# Altium schematic sheet MAKKI_ISMAIL_ESPS3_CAM_1.SchDoc
size 282 x 199 mm; COMPANY: ADAFRUIT INDUSTRIES; DRAWN: KTOWN; REV: B; Origin: Eagle; OriginPath: C:\Users\aliam\OneDrive\Desktop\MAKKI_ISMAIL_ESPS3_CAM\MAKKI_ISMAIL_ESPS3_CAM\MAKKI_ISMAIL_ESPS3_CAM.sch; OriginSheet: 2; GateName_1: G$1; SymbolName_1: FRAME_A4; LibraryName: microbuilder; DeviceSetName: FRAME_A4
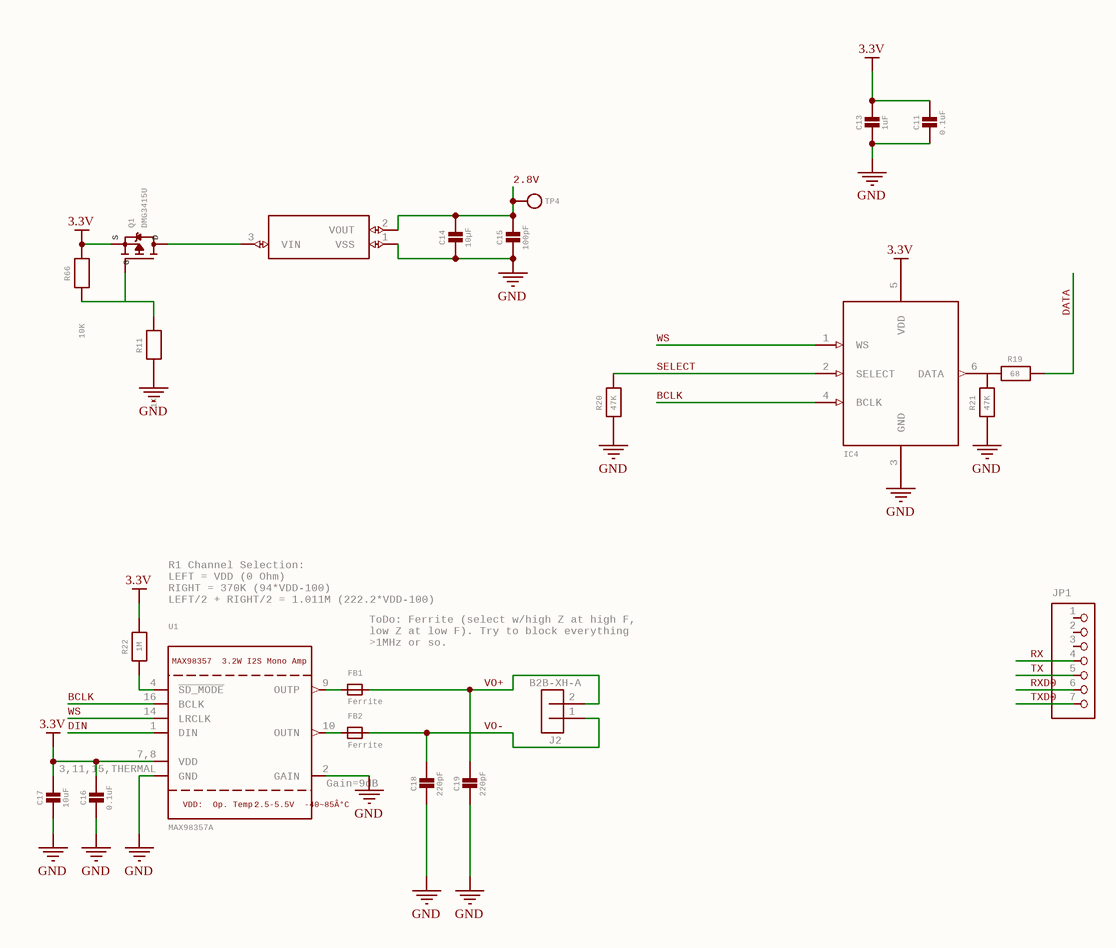
[diagram p0: MAKKI_ISMAIL_ESPS3_CAM_1.SchDoc]

## Parts
C11  0.1uF  [0603-NO]
C13  1uF  [0603-NO]
C14  10µF  [0805-NO]
C15  100pF  [0805-NO]
C16  0.1uF  [0805-NO]
C17  10uF  [0805-NO]
C18  220pF  [0805-NO]
C19  220pF  [0805-NO]
FB1  Ferrite  [0805-NO]
FB2  Ferrite  [0805-NO]
IC3  XC6206P282MR-G  [SOT95P280X130-3N]  (value not drawn)
IC4  ICS-43434  [SPH0645LM4H]  (value not drawn)
J2  B2B-XH-A  [B2B-XH-A]
JP1  HEADER-1X7THICKER  [1X07_ROUND_76]  (value not drawn)
Q1  DMG3415U  [SOT23-R]
R11  1K  [0603-NO]
R19  68  [0603-NO]
R20  47K  [0603-NO]
R21  47K  [0603-NO]
R22  1M  [0805-NO]
R66  10K  [0603-NO]
TP4  TESTPOINTROUND1.5MMNO  [TESTPOINT_ROUND_1.5MM_NO]  (value not drawn)
U1  MAX98357A  MAX98357
3.2WI2SMonoAmp: MAX98357 / 3.2W I2S Mono Amp  VDD:
Op.Temp: VDD: / Op. Temp:  2.5-5.5V
-40~85Â°C: 2.5-5.5V / -40~85Â°C  [QFN16_3MM]

## Nets
3.3V: C11.1 C13.1 C16.1 C17.1 IC4.5(VDD) Q1.2(S) R22.2 R66.2 U1.7,8(VDD)
GND: C11.2 C13.2 C14.2 C15.2 C16.2 C17.2 C18.2 C19.2 IC3.1(VSS) IC4.3(GND) R11.1 R20.1 R21.1 U1.2(GAIN) U1.3,11,15,THERMAL(GND)
2.8V: C14.1 C15.1 IC3.2(VOUT) TP4.P$1
BCLK: IC4.4(BCLK) U1.16(BCLK)
DATA: R19.2
DIN: U1.1(DIN)
RX: JP1.4
RXD0: JP1.6
SELECT: IC4.2(SELECT) R20.2
TX: JP1.5
TXD0: JP1.7
VO+: C19.1 FB1.2(P$2) J2.2
VO-: C18.1 FB2.2(P$2) J2.1
WS: IC4.1(WS) U1.14(LRCLK)
NetFB1_1: FB1.1(P$1) U1.9(OUTP)
NetFB2_1: FB2.1(P$1) U1.10(OUTN)
NetIC3_3: IC3.3(VIN) Q1.3(D)
NetIC4_6: IC4.6(DATA) R19.1 R21.2
NetQ1_1: Q1.1(G) R11.2 R66.1
NetR22_1: R22.1 U1.4(~{SD_MODE})

Not connected (* = marked no-connect by the designer): JP1 1 2 3

## Notes on the sheet
- (near R22) R1 Channel Selection:
  LEFT = VDD (0 Ohm)
  RIGHT = 370K (94*VDD-100)
  LEFT/2 + RIGHT/2 = 1.011M (222.2*VDD-100)
- ToDo: Ferrite (select w/high Z at high F,
  low Z at low F). Try to block everything
  >1MHz or so.
- (near U1) Gain=9dB

## Library data of the parts
C11 C13 = CAP_CERAMIC0603_NO: Ceramic Capacitors   For new designs, use the packages preceded by an '_' character since they are more reliable:   The following footprints should be used on most boards: _0402 - Standard footprint for regular board layouts  _0603 - Standard footprint for regular board layouts  _0805 - Standard footprint for regular board layouts  _1206 - Standard footprint for regular board layouts       For extremely tight-pitch boards where space is at a premium, the following 'micro-pitch' footprints can be used (smaller pads, no silkscreen outline, etc.): _0402MP - Micro-pitch footprint for very dense/compact boards  _0603MP - Micro-pitch footprint for very dense/compact boards  _0805MP - Micro-pitch footprint for very dense/compact boards  _1206MP - Micro-pitch footprint for very dense/compact boards; GateName_1: G$1; SymbolName_1: CAPACITOR; DeviceName: 0603_NO; LibraryName: microbuilder; DeviceSetName: CAP_CERAMIC
C14-C19 = CAP_CERAMIC0805-NOOUTLINE: Ceramic Capacitors   For new designs, use the packages preceded by an '_' character since they are more reliable:   The following footprints should be used on most boards: _0402 - Standard footprint for regular board layouts  _0603 - Standard footprint for regular board layouts  _0805 - Standard footprint for regular board layouts  _1206 - Standard footprint for regular board layouts       For extremely tight-pitch boards where space is at a premium, the following 'micro-pitch' footprints can be used (smaller pads, no silkscreen outline, etc.): _0402MP - Micro-pitch footprint for very dense/compact boards  _0603MP - Micro-pitch footprint for very dense/compact boards  _0805MP - Micro-pitch footprint for very dense/compact boards  _1206MP - Micro-pitch footprint for very dense/compact boards; GateName_1: G$1; SymbolName_1: CAPACITOR; DeviceName: 0805-NOOUTLINE; LibraryName: microbuilder; DeviceSetName: CAP_CERAMIC
FB1 FB2 = FERRITE-0805NO: Ferrite Bead   0603 MMZ1608B121C - 120 Ohm @ 100MHz, 600mA, 0.15 Ohm DC Resistance - Digikey: 445-2164-1-ND  BK1608HW121-T - 120 Ohm, 600mA Ferrite Chip - Digikey: 587-1876-2-ND       0805 HZ0805B272R-10 - 2.7K Ohm @ 100MHz, 200mA, 0.8 Ohm DC Resistance - Digikey: 240-2504-1-ND (see also Murata BLM21BD272SN1L)  MMZ2012Y152B - 1.5K Ohm @ 100MHz, 500mA, 0.4 Ohm DC Resistance - Digikey: 445-1560-1-ND - Mainly for high frequency (80-400MHz)  MMZ2012R102A - 1K Ohm @ 100MHz, 500mA, 0.3 Ohm DC Resistance - Digikey: 445-1555-2-ND - More general purpose (10-200MHz); GateName_1: G$1; SymbolName_1: FERRITE; DeviceName: -0805NO; LibraryName: microbuilder; DeviceSetName: FERRITE
IC3 = XC6206P282MR-G: LDO Voltage Regulators 1uA Low Quiescent 3 Terminal, Low ESR Cap. Compatible, Voltage Regulator   Source:  Datasheet; MANUFACTURER_NAME: Torex; GateName_1: G$1; SymbolName_1: XC6206P282MR-G; LibraryName: SamacSys_Parts; DeviceSetName: XC6206P282MR-G; DESCRIPTION: LDO Voltage Regulators 1uA Low Quiescent 3 Terminal, Low ESR Cap. Compatible, Voltage Regulator; HEIGHT: 1.3mm; MANUFACTURER_PART_NUMBER: XC6206P282MR-G; MOUSER_PART_NUMBER: 865-XC6206P282MR-G; MOUSER_PRICE-STOCK: https://www.mouser.co.uk/ProductDetail/Torex-Semiconductor/XC6206P282MR-G?qs=AsjdqWjXhJ%2Fpd3DOBopSeA%3D%3D
IC4 = MIC_I2S_SPH0645: GateName_1: G$1; SymbolName_1: MIC_I2S; DeviceName: _SPH0645; LibraryName: microbuilder; DeviceSetName: MIC_I2S
J2 = B2B-XH-A: XH Connector Top Entry - 2POS    Reference: : Datasheet; MANUFACTURER: JST Sales America Inc.; PART_STATUS: Active; GateName_1: G$1; SymbolName_1: PINHD2; DESCRIPTION: Connector Header Through Hole 2 position 0.098" (2.50mm); OPERATING_TEMPERATURE: -25°C ~ 85°C; PITCH: 0.098" (2.50mm); LibraryName: Connector; DeviceSetName: B2B-XH-A; CATEGORY: Connectors; DATASHEET: https://www.jst-mfg.com/product/pdf/eng/eXH.pdf; MPN: B2B-XH-A; PACKAGE_SIZE: NA; PACKAGE_TYPE: Through Hole; ROHS: Compliant; SERIES: XH; SUBCATEGORY: Rectangular Connectors; THERMALLOSS: THERMALLOSS; TYPE: Male Headers
JP1 = HEADER-1X7THICKER: PIN HEADER; GateName_1: A; SymbolName_1: PINHD7; DeviceName: THICKER; LibraryName: microbuilder; DeviceSetName: HEADER-1X7
Q1 = MOSFET-P: P-Channel Mosfet   LEGEND   VDS: Voltage Drain-Source ID: Drain Current RDS(ON): Drain-Source On-State Resistance VGS(TH): Gate-Source Threshold Voltage CISS: Drain-Source Input Capacitance    SOT-23   Name	VDS	ID	RDS(ON)	VGS(TH)	CISS	Order Number	   IRLML5103	30V	760mA	600 mOhm	--	75pF @ 25V	Digikey: IRLML5103PBFCT-ND	   IRLML6401	12V	4.3A	50 mOhm	950mV @ 250ÂµA	830pF @ 10V	Digikey: IRLML6401PBFTR-ND	   NTR0202PL	20V	400mA	800 mOhm	2.3V @ 250uA	70pF @ 5V	Digikey: NTR0202PLT1GOSTR-ND	   NTR4101PT1G	20V	1.8A	85 mOhm	1.2V @ 250uA	675pF @ 10V	Digikey: NTR4101PT1GOSCT-ND	   DMP2004K	20V	600mA	900 mOhm	1V @ 250uA	175pF @ 16V	Digikey: DMP2004KDICT-ND	   PMV65XP	20V	3.9A	76 mOhm	950mV @ 1mA	725pF @ 20V	Digikey: 568-2358-2-ND	   							   							TO-252   Name	VDS	ID	RDS(ON)	VGS(TH)	CISS	Order Number	   AOD417	30V	25A	34 mOhm	3V @ 250ÂµA	920pF @ 15V	Digikey: 785-1106-2-ND	PowerPak   Name	VDS	ID	RDS(ON)	VGS(TH)	CISS	Order Number	   AON7401	30V	12A	14 mOhm	3V @ 250ÂµA	2600pF @ 15V	Digikey: 785-1302-1-ND; GateName_1: G$1; SymbolName_1: MOSFET-P; LibraryName: microbuilder; DeviceSetName: MOSFET-P; D: D; S: S; G: G
R11 R19-R21 R66 = RESISTOR_0603_NOOUT: Resistors   For new designs, use the packages preceded by an '_' character since they are more reliable:   The following footprints should be used on most boards: _0402 - Standard footprint for regular board layouts  _0603 - Standard footprint for regular board layouts  _0805 - Standard footprint for regular board layouts  _1206 - Standard footprint for regular board layouts       For extremely tight-pitch boards where space is at a premium, the following 'micro-pitch' footprints can be used (smaller pads, no silkscreen outline, etc.): _0402MP - Micro-pitch footprint for very dense/compact boards  _0603MP - Micro-pitch footprint for very dense/compact boards  _0805MP - Micro-pitch footprint for very dense/compact boards  _1206MP - Micro-pitch footprint for very dense/compact boards; GateName_1: G$1; SymbolName_1: RESISTOR; DeviceName: _0603_NOOUT; LibraryName: microbuilder; DeviceSetName: RESISTOR
R22 = RESISTOR0805_NOOUTLINE: Resistors   For new designs, use the packages preceded by an '_' character since they are more reliable:   The following footprints should be used on most boards: _0402 - Standard footprint for regular board layouts  _0603 - Standard footprint for regular board layouts  _0805 - Standard footprint for regular board layouts  _1206 - Standard footprint for regular board layouts       For extremely tight-pitch boards where space is at a premium, the following 'micro-pitch' footprints can be used (smaller pads, no silkscreen outline, etc.): _0402MP - Micro-pitch footprint for very dense/compact boards  _0603MP - Micro-pitch footprint for very dense/compact boards  _0805MP - Micro-pitch footprint for very dense/compact boards  _1206MP - Micro-pitch footprint for very dense/compact boards; GateName_1: G$1; SymbolName_1: RESISTOR; DeviceName: 0805_NOOUTLINE; LibraryName: microbuilder; DeviceSetName: RESISTOR
TP4 = TESTPOINTROUND1.5MMNO: Test Point   Various test points for characterisation and PCB testing    TESTPOINT_SMT - Compact Surface Mount Test Point [Digikey: 5016KTR-ND]; GateName_1: G$1; SymbolName_1: TESTPOINT; DeviceName: ROUND1.5MMNO; LibraryName: microbuilder; DeviceSetName: TESTPOINT
U1 = AUDIOAMP_MAX98357: MAX98357 - 3.2W I2S Mono Audio Amp; GateName_1: G$1; SymbolName_1: MAX98357; LibraryName: microbuilder; DeviceSetName: AUDIOAMP_MAX98357